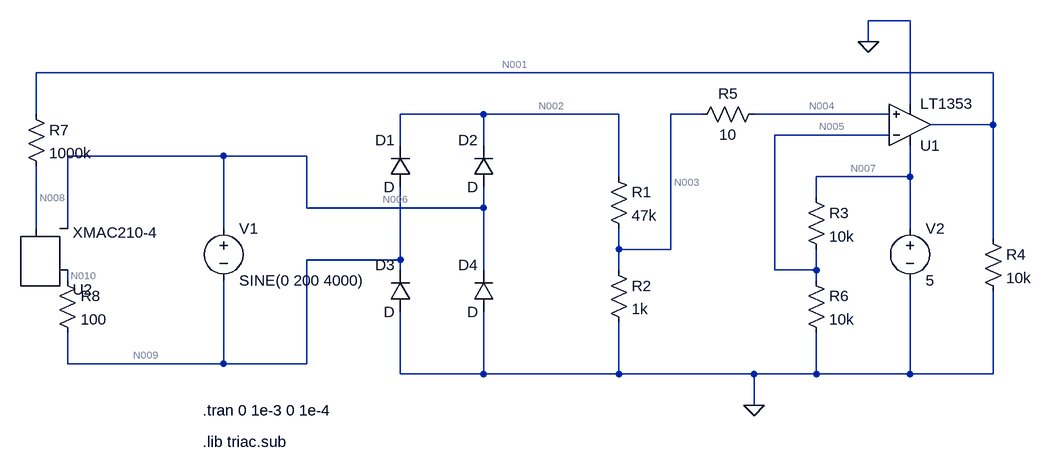
[diagram p0: schematic hv_sync_sim.asc]
hv_sync_sim.asc, the LTspice schematic file:
Version 4
SHEET 1 1520 680
WIRE 784 -384 720 -384
WIRE 720 -352 720 -384
WIRE 912 -304 -560 -304
WIRE 784 -256 784 -384
WIRE -560 -240 -560 -304
WIRE 128 -240 0 -240
WIRE 336 -240 128 -240
WIRE 464 -240 416 -240
WIRE 752 -240 544 -240
WIRE 912 -224 912 -304
WIRE 912 -224 816 -224
WIRE 752 -208 576 -208
WIRE 0 -192 0 -240
WIRE 128 -192 128 -240
WIRE -272 -176 -512 -176
WIRE -144 -176 -272 -176
WIRE 336 -144 336 -240
WIRE 784 -144 784 -192
WIRE 784 -144 640 -144
WIRE 640 -112 640 -144
WIRE -144 -96 -144 -176
WIRE 128 -96 128 -128
WIRE 128 -96 -144 -96
WIRE -560 -64 -560 -160
WIRE -512 -64 -512 -176
WIRE -272 -64 -272 -176
WIRE 784 -64 784 -144
WIRE 912 -48 912 -224
WIRE 336 -32 336 -64
WIRE 416 -32 416 -240
WIRE 416 -32 336 -32
WIRE 0 -16 0 -128
WIRE 0 -16 -144 -16
WIRE 0 0 0 -16
WIRE 128 0 128 -96
WIRE 336 0 336 -32
WIRE 576 0 576 -208
WIRE 640 0 640 -32
WIRE 640 0 576 0
WIRE -512 16 -512 0
WIRE 640 16 640 0
WIRE -512 144 -512 96
WIRE -272 144 -272 16
WIRE -272 144 -512 144
WIRE -144 144 -144 -16
WIRE -144 144 -272 144
WIRE 0 160 0 64
WIRE 128 160 128 64
WIRE 128 160 0 160
WIRE 336 160 336 80
WIRE 336 160 128 160
WIRE 544 160 336 160
WIRE 640 160 640 96
WIRE 640 160 544 160
WIRE 784 160 784 16
WIRE 784 160 640 160
WIRE 912 160 912 32
WIRE 912 160 784 160
WIRE 544 208 544 160
FLAG 544 208 0
FLAG 720 -352 0
SYMBOL voltage -272 -80 R0
WINDOW 123 0 0 Left 2
WINDOW 39 0 0 Left 2
SYMATTR InstName V1
SYMATTR Value SINE(0 200 4000)
SYMBOL voltage 784 -80 R0
WINDOW 123 0 0 Left 2
WINDOW 39 0 0 Left 2
SYMATTR InstName V2
SYMATTR Value 5
SYMBOL res 320 -160 R0
SYMATTR InstName R1
SYMATTR Value 47k
SYMBOL res 320 -16 R0
SYMATTR InstName R2
SYMATTR Value 1k
SYMBOL Opamps\\LT1353 784 -160 M180
SYMATTR InstName U1
SYMBOL res 896 -64 R0
SYMATTR InstName R4
SYMATTR Value 10k
SYMBOL res 560 -256 R90
WINDOW 0 0 56 VBottom 2
WINDOW 3 32 56 VTop 2
SYMATTR InstName R5
SYMATTR Value 10
SYMBOL diode 16 -128 R180
WINDOW 0 24 72 Left 2
WINDOW 3 24 0 Left 2
SYMATTR InstName D1
SYMBOL diode 144 -128 R180
WINDOW 0 24 72 Left 2
WINDOW 3 24 0 Left 2
SYMATTR InstName D2
SYMBOL diode 16 64 R180
WINDOW 0 24 72 Left 2
WINDOW 3 24 0 Left 2
SYMATTR InstName D3
SYMBOL diode 144 64 R180
WINDOW 0 24 72 Left 2
WINDOW 3 24 0 Left 2
SYMATTR InstName D4
SYMBOL res 624 -128 R0
SYMATTR InstName R3
SYMATTR Value 10k
SYMBOL res 624 0 R0
SYMATTR InstName R6
SYMATTR Value 10k
SYMBOL Misc\\TRIAC -544 0 M180
SYMATTR InstName U2
SYMATTR Value XMAC210-4
SYMBOL res -576 -256 R0
SYMATTR InstName R7
SYMATTR Value 1000k
SYMBOL res -528 0 R0
SYMATTR InstName R8
SYMATTR Value 100
TEXT -304 216 Left 2 !.tran 0 1e-3 0 1e-4
TEXT -304 264 Left 2 !.lib triac.sub

The netlist it stands for:
* hv_sync_sim.asc
V1 N006 N009 SINE(0 200 4000)
V2 N007 0 5
R1 N002 N003 47k
R2 N003 0 1k
XU1 N004 N005 N007 0 N001 LT1353  ; pins In+ In- V+ V- OUT
R4 N001 0 10k
R5 N004 N003 10
D1 N009 N002 D
D2 N006 N002 D
D3 0 N009 D
D4 0 N006 D
R3 N007 N005 10k
R6 N005 0 10k
XU2 N010 N008 N006 XMAC210-4  ; pins MT2 G MT1
R7 N001 N008 1000k
R8 N010 N009 100
.model D D
.lib standard.dio
.tran 0 1e-3 0 1e-4
.lib triac.sub
.backanno
.end

* Results of the author's LTspice run, read from the files saved beside the schematic
* Operating Point, zero values left out:
*   V(n006) = 454.3 mV
*   V(n009) = 454.3 mV
*   V(n007) = 5 V
*   V(n002) = 19.39 mV
*   V(n003) = 530.3 µV
*   V(n005) = 2.499 V
*   V(n004) = 531.6 µV
*   V(n001) = 855.5 mV
*   V(n010) = 454.3 mV
*   V(n008) = 454.3 mV
*   I(D2) = 200.6 nA
*   I(D1) = 200.6 nA
*   I(R7) = 401.2 nA
*   I(R6) = 249.9 µA
*   I(R3) = 250.1 µA
*   I(R5) = 129.1 nA
*   I(R4) = 85.55 µA
*   I(R2) = 530.3 nA
*   I(R1) = 401.2 nA
*   I(V2) = -545 µA
*   I(V1) = 200.6 nA
*   Ix(u1:1) = -129.1 nA
*   Ix(u1:2) = 135.5 nA
*   Ix(u1:3) = 294.9 µA
*   Ix(u1:4) = -209 µA
*   Ix(u1:5) = -85.95 µA
*   Ix(u2:2) = 401.2 nA
*   Ix(u2:3) = -401.2 nA
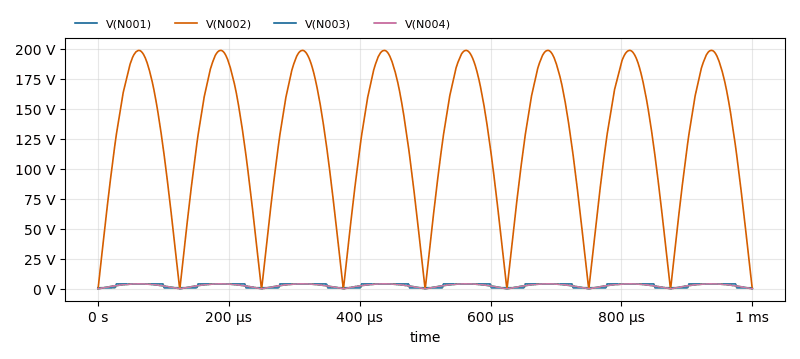
[diagram p1: Transient Analysis of hv_sync_sim.asc, plotted from the saved traces]
* Transient Analysis, 1 run:
*   V(N001): min 855.3 mV, max 4.119 V, average 2.759 V, rms 3.182 V, last 855.5 mV
*   V(N002): min 18.54 mV, max 198.6 V, average 125.7 V, rms 140 V, last 19.53 mV
*   V(N003): min 510.9 µV, max 4.138 V, average 2.618 V, rms 2.917 V, last 550.4 µV
*   V(N004): min 512.2 µV, max 4.138 V, average 2.618 V, rms 2.917 V, last 551.8 µV